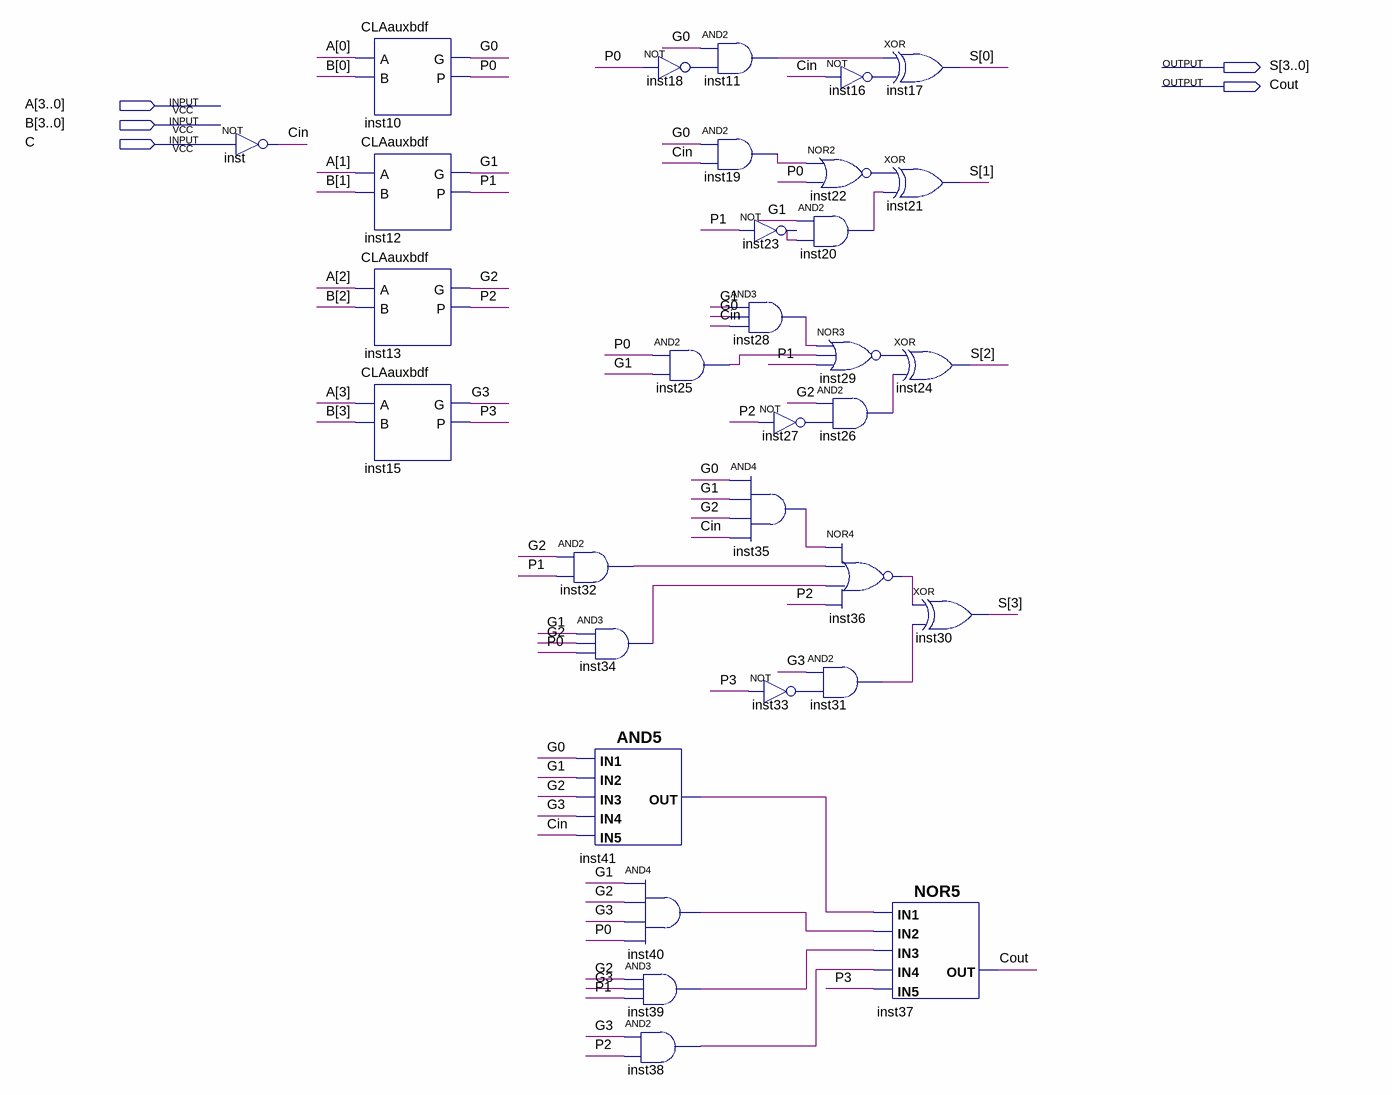
[diagram p0: schematic sheet]
// Quartus schematic CLA4bits.bdf as structural Verilog: 32 symbols, 5 pins
module CLA4bits (
  input  [3:0] A,
  input  [3:0] B,
  input  C,
  output [3:0] S,
  output Cout
);

  wire Cin, G0, G1, G2, G3, inst11_out, inst16_out, inst18_out, inst19_out, inst20_out, inst22_out,
       inst23_out, inst25_out, inst26_out, inst27_out, inst28_out, inst29_out, inst31_out, inst32_out,
       inst33_out, inst34_out, inst35_out, inst36_out, inst38_out, inst39_out, inst40_out, inst41_out, P0,
       P1, P2, P3;

  not inst (Cin, C);
  CLAauxbdf inst10 (.A(A[0]), .B(B[0]), .G(G0), .P(P0));
  CLAauxbdf inst12 (.A(A[1]), .B(B[1]), .G(G1), .P(P1));
  CLAauxbdf inst13 (.A(A[2]), .B(B[2]), .G(G2), .P(P2));
  CLAauxbdf inst15 (.A(A[3]), .B(B[3]), .G(G3), .P(P3));
  and inst32 (inst32_out, G2, P1);
  and inst34 (inst34_out, G1, G2, P0);
  and inst41 (inst41_out, G0, G1, G2, G3, Cin);
  not inst18 (inst18_out, P0);
  and inst25 (inst25_out, P0, G1);
  and inst40 (inst40_out, G1, G2, G3, P0);
  and inst39 (inst39_out, G2, G3, P1);
  and inst38 (inst38_out, G3, P2);
  and inst11 (inst11_out, G0, inst18_out);
  and inst19 (inst19_out, G0, Cin);
  not inst23 (inst23_out, P1);
  and inst28 (inst28_out, G1, G0, Cin);
  and inst35 (inst35_out, G0, G1, G2, Cin);
  not inst33 (inst33_out, P3);
  not inst16 (inst16_out, Cin);
  nor inst22 (inst22_out, inst19_out, P0);
  and inst20 (inst20_out, G1, inst23_out);
  nor inst29 (inst29_out, inst28_out, inst25_out, P1);
  and inst26 (inst26_out, G2, inst27_out);
  not inst27 (inst27_out, P2);
  nor inst36 (inst36_out, inst35_out, inst32_out, inst34_out, P2);
  and inst31 (inst31_out, G3, inst33_out);
  xor inst17 (S[0], inst11_out, inst16_out);
  xor inst21 (S[1], inst22_out, inst20_out);
  xor inst24 (S[2], inst29_out, inst26_out);
  nor inst37 (Cout, inst41_out, inst40_out, inst39_out, inst38_out, P3);
  xor inst30 (S[3], inst36_out, inst31_out);
endmodule
